# EAGLE design LPC_4TE_TOP_3_52 (EAGLE 5.04)
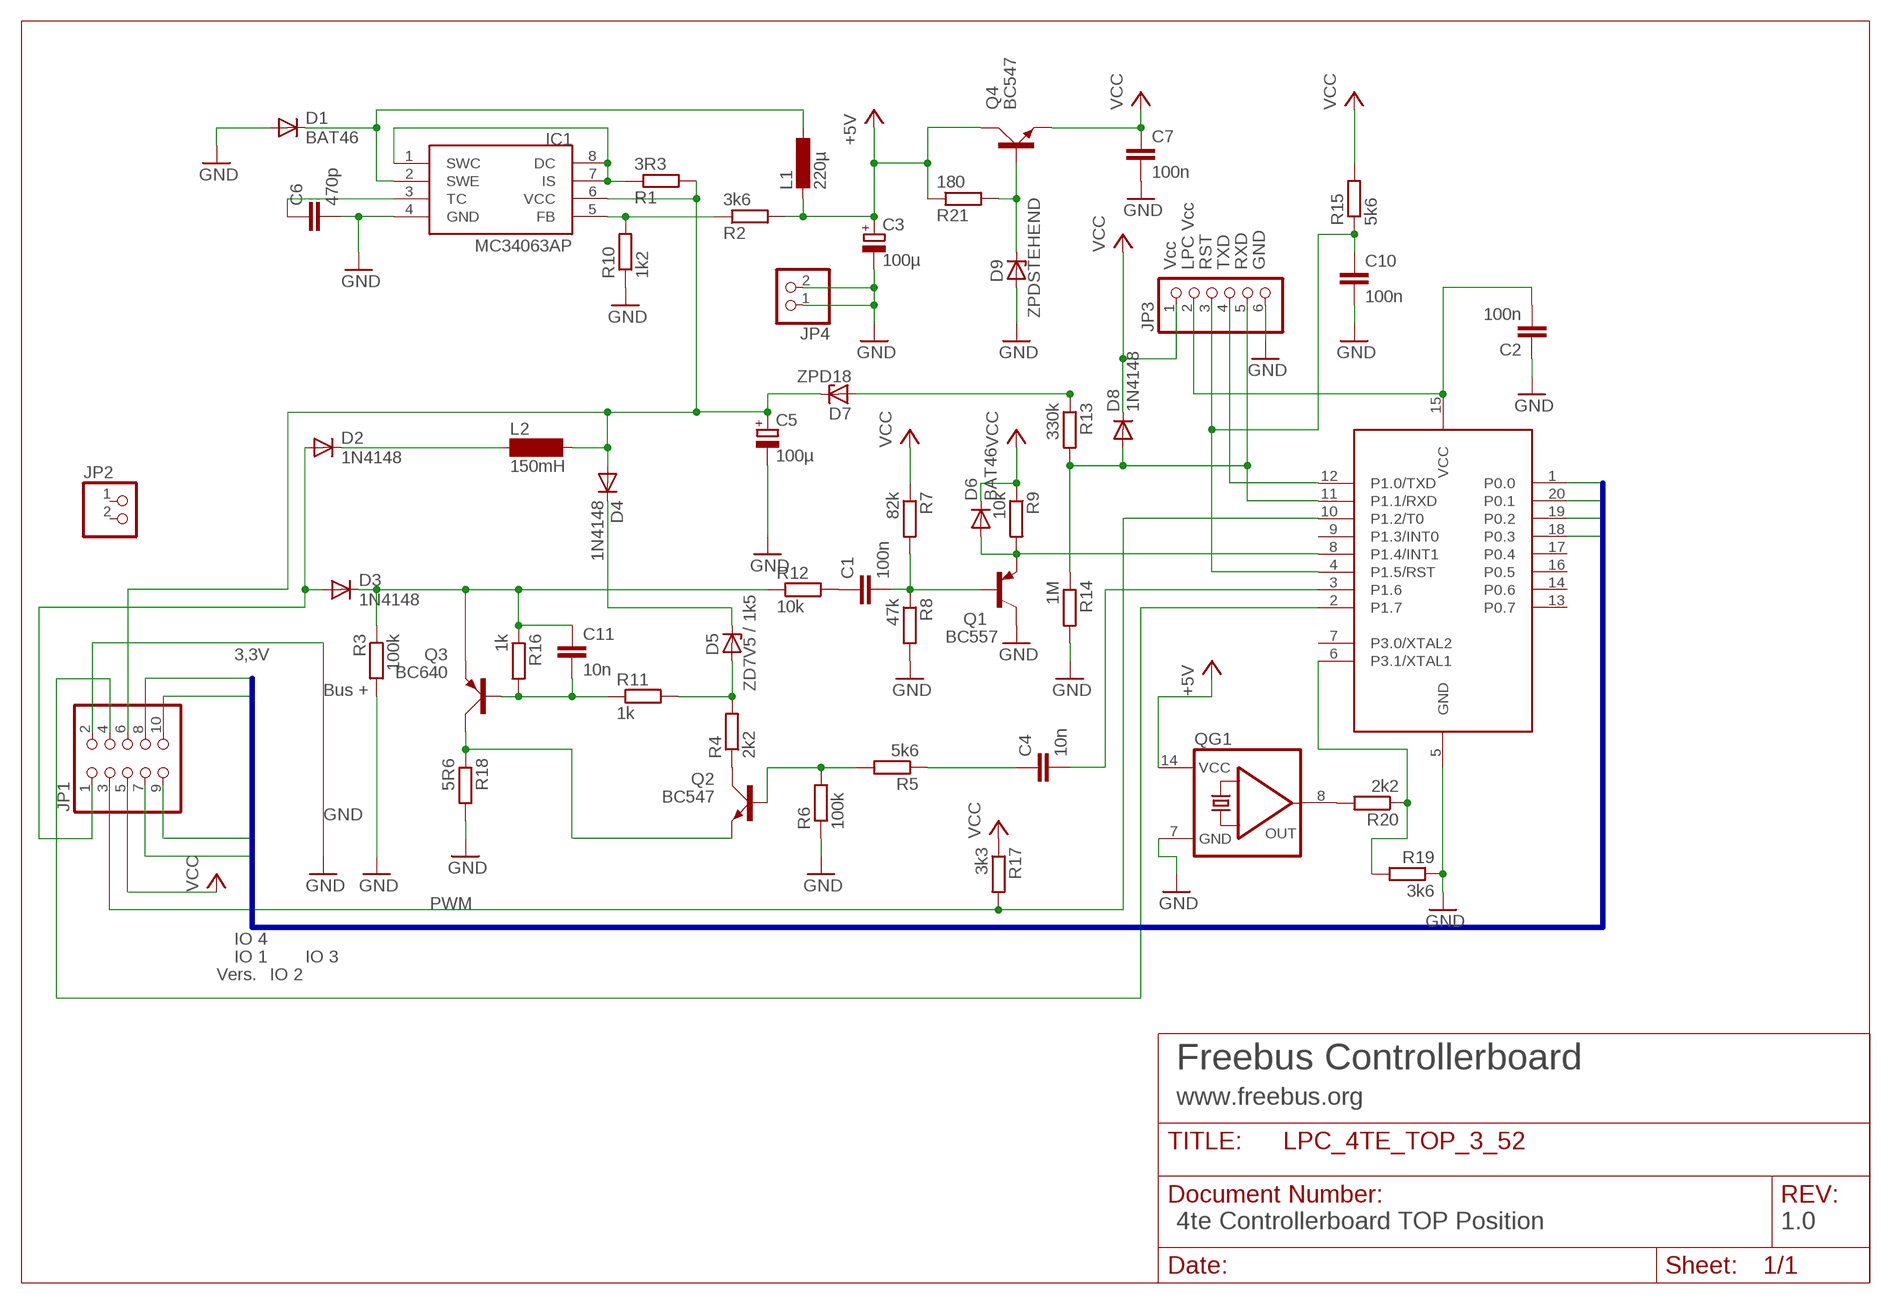
[diagram p0: schematic, sheet 1]

## Parts
89LPC922  89LPC922  [DIL20]
C1  100n  C-EU050-024X044  [C050-024X044]
C2  100n  C-EU025-025X050  [C025-025X050]
C3  100µ  CPOL-EUE2.5-6  [E2,5-6]
C4  10n  C-EUC1206  [C1206]
C5  100µ  CPOL-EUE3.5-8  [E3,5-8]
C6  470p  C-EU025-024X044  [C025-024X044]
C7  100n  C-EU025-025X050  [C025-025X050]
C10  100n  C-EU025-025X050  [C025-025X050]
C11  10n  C-EU050-024X044  [C050-024X044]
D1  BAT46  BAT81  [DO34-7]
D2  1N4148  [DO35-10]
D3  1N4148  [DO35-10]
D4  1N4148  [DO35-10]
D5  ZD7V5 / 1k5  ZPD  [DO35Z10]
D6  BAT46  1N4148  [DO35-10]
D7  ZPD18  ZPD  [DO35Z10]
D8  1N4148  [DO35-10]
D9  ZPDSTEHEND  [ZDIODE]
IC1  MC34063AP  [DIL08]
JP1  PINHD-2X5  [2X05]
JP2  PINHD-1X2  [1X02]
JP3  PINHD-1X6  [1X06]
JP4  PINHD-1X2  [1X02]
L1  220µ  L-EU0207/12  [0207/12]
L2  150mH  BS11  [BS11]
Q1  BC557  [TO92]
Q2  BC547  [SOT54A]
Q3  BC640  [SOT54D]
Q4  BC547  [SOT54A]
QG1  QG5860  [DIL14S]
R1  3R3  R-EU_0204/7  [0204/7]
R2  3k6  R-EU_0204/7  [0204/7]
R3  100k  R-EU_0207/2V  [0207/2V]
R4  2k2  R-EU_R1206  [R1206]
R5  5k6  R-EU_R1206  [R1206]
R6  100k  R-EU_R1206  [R1206]
R7  82k  R-EU_0204/7  [0204/7]
R8  47k  R-EU_0207/2V  [0207/2V]
R9  10k  R-EU_0204/7  [0204/7]
R10  1k2  R-EU_0204/7  [0204/7]
R11  1k  R-EU_R1206  [R1206]
R12  10k  R-EU_0207/2V  [0207/2V]
R13  330k  R-EU_0207/2V  [0207/2V]
R14  1M  R-EU_0207/2V  [0207/2V]
R15  5k6  R-EU_0207/2V  [0207/2V]
R16  1k  R-EU_0207/2V  [0207/2V]
R17  3k3  R-EU_0204/7  [0204/7]
R18  5R6  R-EU_0207/2V  [0207/2V]
R19  3k6  R-EU_R1206  [R1206]
R20  2k2  R-EU_R1206  [R1206]
R21  180  R-EU_0207/2V  [0207/2V]

## Nets
+5V: C3.+ L1.2 Q4.C QG1.14(VCC) R2.2 R21.1
/RESET: 89LPC922.4(P1.5/RST) C10.1 JP3.3 R15.1
EIB+: D2.A D3.A JP1.1
GND: 89LPC922.5(GND) C2.1 C3.- C5.- C6.2 C7.2 C10.2 D1.A D9.A IC1.4(GND) JP1.2 JP3.6 JP4.1 JP4.2 Q1.3(C) QG1.7(GND) R3.2 R6.1 R8.2 R10.1 R14.2 R18.2 R19.1
N$1: 89LPC922.8(P1.4/INT1) D6.A Q1.1(E) R9.2
N$2: C1.2 Q1.2(B) R7.2 R8.1
N$3: QG1.8(OUT) R20.2
N$4: Q2.E Q3.C R18.1
N$5: 89LPC922.3(P1.6) C4.2
N$6: 89LPC922.6(P3.1/XTAL1) R19.2 R20.1
N$7: Q2.B R5.2 R6.2
N$8: IC1.1(SWC) IC1.7(IS) IC1.8(DC) R1.1
N$10: 89LPC922.11(P1.1/RXD) D8.A JP3.5 R13.2 R14.1
N$11: IC1.5(FB) R2.1 R10.2
N$12: D1.C IC1.2(SWE) L1.1
N$13: D2.C L2.1
N$14: C6.1 IC1.3(TC)
N$15: D4.C D5.C
N$16: C1.1 R12.2
N$17: C4.1 R5.1
N$18: Q2.C R4.1
N$19: D5.A R4.2 R11.2
N$20: C11.1 D3.C Q3.E R3.1 R12.1 R16.1
N$23: D9.C Q4.B R21.2
N$25: D7.A R13.1
N$28: C11.2 Q3.B R11.1 R16.2
N$29: 89LPC922.12(P1.0/TXD) JP3.4
N$32: 89LPC922.15(VCC) C2.2 JP3.2
P0.0: 89LPC922.1(P0.0) JP1.7
P0.1: 89LPC922.20(P0.1) JP1.8
P0.2: 89LPC922.19(P0.2) JP1.9
P0.3: 89LPC922.18(P0.3) JP1.10
PROG: 89LPC922.2(P1.7) JP1.4
PWM: 89LPC922.10(P1.2/T0) JP1.3 R17.2
VCC: C7.1 D6.C D8.C JP1.5 JP3.1 Q4.E R7.1 R9.1 R15.2 R17.1
VERS: C5.+ D4.A D7.C IC1.6(VCC) JP1.6 L2.2 R1.2
Unconnected: 89LPC922.7(P3.0/XTAL2) 89LPC922.9(P1.3/INT0) 89LPC922.13(P0.7) 89LPC922.14(P0.6) 89LPC922.16(P0.5) 89LPC922.17(P0.4) JP2.1 JP2.2

## Buses
P0.[0..3]

## Notes on the sheet
- Vcc | LPC Vcc | RST | TXD | RXD | GND
- 3,3V
- Bus +
- GND
- PWM
- IO 4
- IO 1 | IO 3
- Vers. | IO 2
- Freebus Controllerboard
- www.freebus.org
- 4te Controllerboard TOP Position | 1.0

## Library data of the parts
89LPC922 = micro-philips:89LPC922
C1 C2 C4 C6 C7 C10 C11 = rcl:C-EU: CAPACITOR, European symbol
C3 C5 = rcl:CPOL-EU: POLARIZED CAPACITOR, European symbol
D1 = diode:BAT81: DIODE barrier diode
D2-D4 D6 D8 = diode:1N4148: DIODE high speed (Philips)
D5 D7 D9 = diode:ZPD: Z DIODE 500 mW
IC1 = mc34063:MC34063
JP1 = pinhead:PINHD-2X5: PIN HEADER
JP2 JP4 = pinhead:PINHD-1X2: PIN HEADER
JP3 = pinhead:PINHD-1X6: PIN HEADER
L1 = rcl:L-EU: INDUCTOR, European symbol
L2 = inductor-neosid:BS: INDUCTOR nominal inductance, magnetically screened
Q1 = transistor-pnp:BC557: PNP Transistor
Q2 Q4 = transistor-small-signal:BC547: NPN TRANSISTOR
Q3 = transistor-small-signal:BC640: PNP TRANSISTOR
QG1 = crystal:QG5860: CRYSTAL RESONATOR
R1-R21 = rcl:R-EU_: RESISTOR, European symbol

## Board
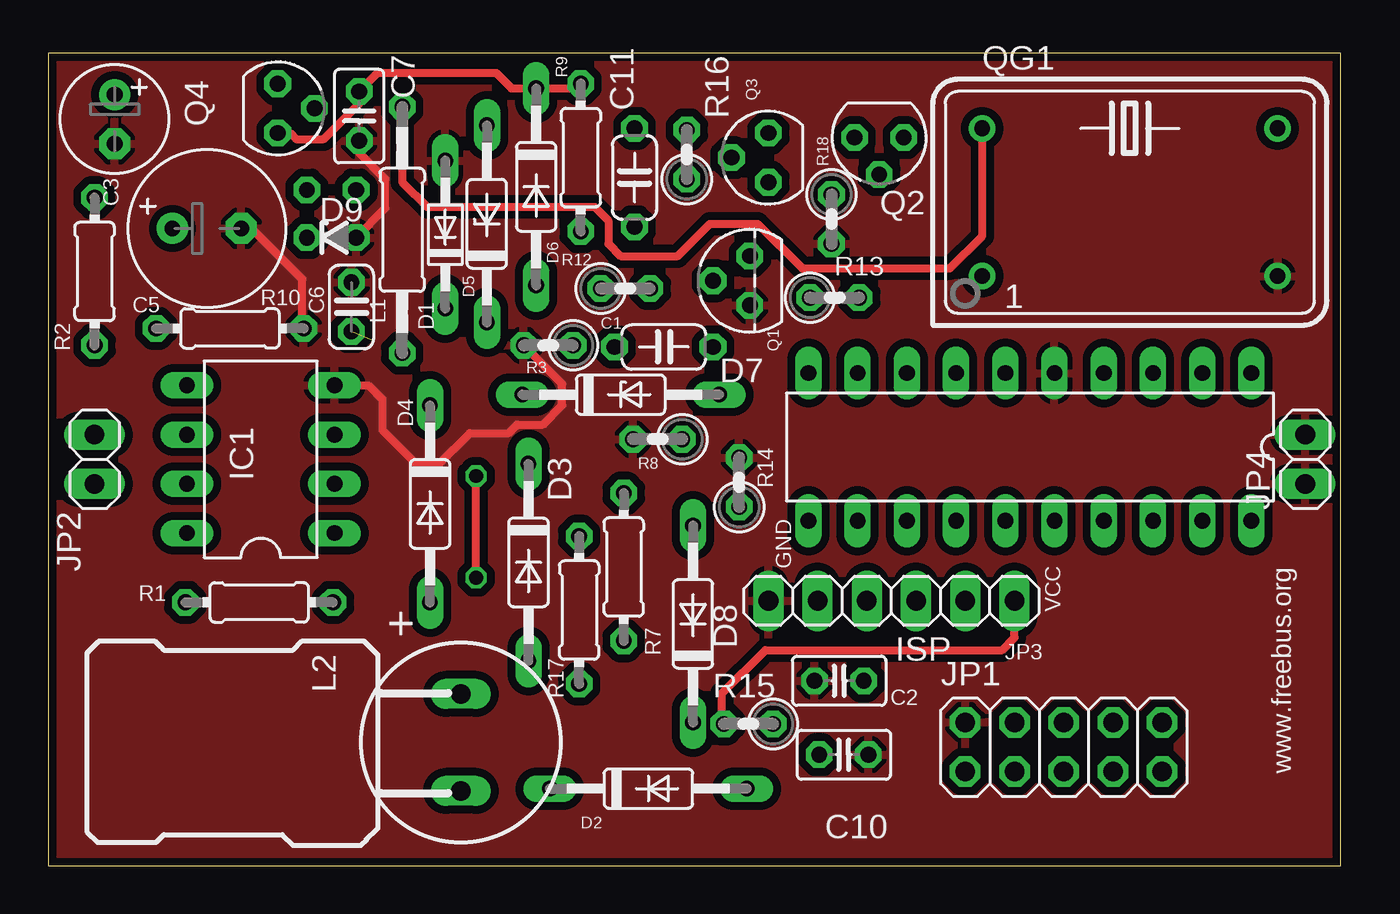
[diagram p1: board, top side]
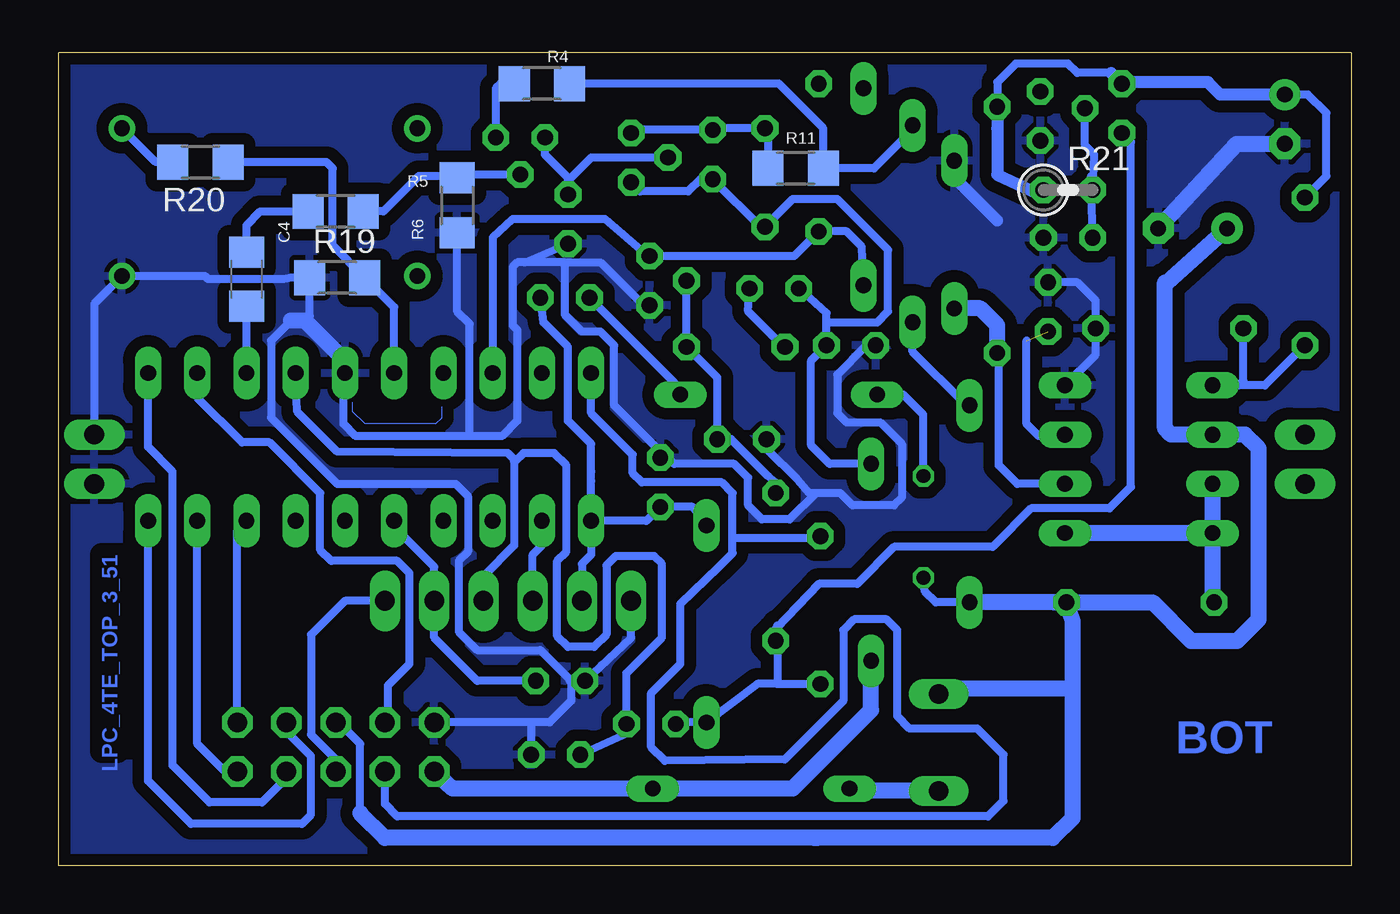
[diagram p2: board, bottom side, seen from below]

Size 66.68 x 41.91 mm. Coordinates in mm from the lower left corner, seen from the top.
Outline: 0,41.91 0,0 66.68,0 66.68,41.91 0,41.91
Copper layers (1*16): Top 0.035mm / dielectric 1.5mm / Bottom 0.035mm
Design rules "default_freebus": minimum track width 10mil, minimum drill 24mil, track to track 8mil, track to pad 8mil, pad to pad 8mil, via to via 8mil, smd to smd 8mil, copper to edge 12mil, drill to drill 8mil, minimum pad ring 11mil, minimum via ring 8mil, stop-mask expansion 4mil, vias tented up to drill 0mil, thermal gap 10mil

### Footprints (pad centres in the part's own frame; a part is rotated, then mirrored left to right if it is on the bottom)
DIL20@1 = drill 0.813 long: 1 -11.43,-3.81; 2 -8.89,-3.81; 3 -6.35,-3.81; 4 -3.81,-3.81; 5 -1.27,-3.81; 6 1.27,-3.81; 7 3.81,-3.81; 8 6.35,-3.81; 9 8.89,-3.81; 10 11.43,-3.81; 11 11.43,3.81; 12 8.89,3.81; 13 6.35,3.81; 14 3.81,3.81; 15 1.27,3.81; 16 -1.27,3.81; 17 -3.81,3.81; 18 -6.35,3.81; 19 -8.89,3.81; 20 -11.43,3.81
C050-024X044 = drill 0.813 octagon: 1 -2.54,0; 2 2.54,0
C025-025X050 = drill 0.813 octagon: 1 -1.27,0; 2 1.27,0
E2,5-6 = drill 0.813 pad 1.6 round: + -1.27,0 | drill 0.813 pad 1.6 octagon: - 1.27,0
C1206 = smd 1.6 x 1.8: 1 -1.4,0; 2 1.4,0
E3,5-8 = drill 0.813 pad 1.6 round: + -1.778,0 | drill 0.813 pad 1.6 octagon: - 1.778,0
C025-024X044 = drill 0.813 octagon: 1 -1.27,0; 2 1.27,0
DO34-7 = drill 0.813 long: A 3.81,0; C -3.81,0
DO35-10 = drill 0.813 long: A 5.08,0; C -5.08,0
DO35Z10 = drill 0.813 long: A 5.08,0; C -5.08,0
ZDIODE = drill 0.813 octagon: A 1.27,0; C -1.27,0
DIL08 = drill 0.813 long: 1 -3.81,-3.81; 2 -1.27,-3.81; 3 1.27,-3.81; 4 3.81,-3.81; 5 3.81,3.81; 6 1.27,3.81; 7 -1.27,3.81; 8 -3.81,3.81
2X05 = drill 1.016 octagon: 1 -5.08,-1.27; 2 -5.08,1.27; 3 -2.54,-1.27; 4 -2.54,1.27; 5 0,-1.27; 6 0,1.27; 7 2.54,-1.27; 8 2.54,1.27; 9 5.08,-1.27; 10 5.08,1.27
1X02 = drill 1.016 long: 1 -1.27,0; 2 1.27,0
1X06 = drill 1.016 long: 1 -6.35,0; 2 -3.81,0; 3 -1.27,0; 4 1.27,0; 5 3.81,0; 6 6.35,0
0207/12 = drill 0.813 octagon: 1 -6.35,0; 2 6.35,0
BS11 = drill 1 long: 1 -2.5,0; 2 2.5,0
TO92 = drill 0.813 octagon: 1 1.27,0; 2 0,1.905; 3 -1.27,0
SOT54A = drill 0.813 octagon: B 0,1.905; C -1.27,0; E 1.27,0
SOT54D = drill 0.813 octagon: B 1.27,0; C 0,1.905; E -1.27,0
DIL14S = drill 0.813 round: 1 -7.62,-3.81; 7 7.62,-3.81; 8 7.62,3.81; 14 -7.62,3.81
0204/7 = drill 0.813 octagon: 1 -3.81,0; 2 3.81,0
0207/2V = drill 0.813 octagon: 1 -1.27,0; 2 1.27,0
R1206 = smd 1.6 x 1.803: 1 -1.422,0; 2 1.422,0

### Placement (x,y rotation side)
89LPC922  89LPC922  [DIL20@1]  50.64,21.59 180 top
C1  31.75,26.75 0 top
C2  40.8,9.53 0 top
C3  3.41,38.5 270 top
C4  56.99,30.24 270 bottom
C5  8.17,32.86 0 top
C6  15.64,28.81 90 top
C7  16.03,38.66 270 top
C10  41.04,5.72 0 top
C11  30.24,35.48 90 top
D1  20.48,32.54 90 top
D2  30.96,3.97 0 top
D3  24.76,15.64 270 top
D4  19.68,18.65 270 top
D5  22.62,33.1 90 top
D6  25.16,35.01 270 top
D7  29.53,24.29 0 top
D8  33.26,12.46 90 top
D9  14.6,32.39 0 top
IC1  10.95,20.96 90 top
JP1  52.39,6.11 0 top
JP2  2.38,20.96 90 top
JP3  43.5,13.65 180 top
JP4  64.85,20.96 90 top
L1  18.26,32.78 90 top
L2  21.27,6.35 90 top
Q1  36.19,30.16 90 top
Q2  42.86,37.55 180 top
Q3  37.15,36.51 90 top
Q4  11.83,39.05 270 top
QG1  55.8,34.21 0 top
R1  10.87,13.57 0 top
R2  2.38,30.64 90 top
R3  25.8,26.83 180 top
R4  41.75,40.32 0 bottom
R5  52.39,33.73 0 bottom
R6  46.12,34.05 90 bottom
R7  29.69,15.4 90 top
R8  31.43,21.99 180 top
R9  27.46,36.51 270 top
R10  9.37,27.7 180 top
R11  28.65,35.96 0 bottom
R12  29.76,29.77 0 top
R13  40.56,29.29 0 top
R14  35.64,19.76 90 top
R15  36.12,7.3 180 top
R16  32.94,36.67 90 top
R17  27.38,13.18 90 top
R18  40.4,33.34 270 top
R19  52.31,30.32 0 bottom
R20  59.37,36.27 180 bottom
R21  14.6,34.85 0 bottom

### Tracks (layer width: path | path; a pad name or v marks a point on that pad's centre or on a via)
+5V
  Top 0.406: L1.2 18.26,35.24 19.53,33.97 28.18,33.97 28.89,33.26 28.89,32.07 29.53,31.43 32.46,31.43 34.13,33.1 36.59,33.1 38.89,30.8 46.51,30.8 48.18,32.46 QG1.14
  Bottom 0.406: C3.+ 2.22,39.77 1.27,38.81 1.27,35.56 R2.2 | 12.38,40.88 14.13,40.88 14.6,41.35 17.3,41.35 18.26,40.4 L1.2
  Bottom 0.61: C3.+ 6.75,39.77 7.38,40.4 11.75,40.4 Q4.C 12.38,40.88 | 18.26,39.37 L1.2 18.26,38.02 18.26,35.64 16.19,34.69 R21.1
/RESET
  Bottom 0.406: 89LPC922.4 54.37,23.42 52.31,21.35 43.5,21.27 43.18,20.96 43.18,20.8 | 43.18,20.8 43.18,16.51 44.77,14.92 JP3.3 | 43.18,20.8 42.7,21.27 41.12,21.27 40.48,20.64 40.48,16.19 40.96,15.72 40.96,11.83 40.4,11.27 39.05,11.27 38.42,11.91 38.42,15.48 37.94,15.95 35.96,15.95 35.56,15.56 35.56,11.75 37.39,9.92 R15.1 37.31,6.83 C10.1
EIB+
  Bottom 0.813: JP1.1 46.35,3.97 40.8,3.97 D2.A 28.81,3.97 24.76,8.02 D3.A 24.76,10.24
GND
  Top 0.406: C5.- 10.16,33.18 13.1,30.24 13.1,27.78 R10.1 | IC1.4 16.51,24.77 17.22,24.05 17.22,22.46 18.97,20.72 20.16,20.72 21.75,22.3 23.73,22.3 24.17,22.74 25.52,22.74 26.51,23.73 26.51,24.84 R3.2 | C7.2 16.03,36.75 17.38,35.4 17.38,33.89 D9.A
  Bottom 0.406: 40.24,9.53 40.24,8.49 41.35,7.38 42.31,7.38 | 40.24,9.53 41.83,11.11 45.08,11.11 46.04,12.07 46.04,12.54 46.04,15.72 45.56,16.19 45.56,19.05 46.2,19.69 52.31,19.69 55.72,23.1 55.72,27.07 54.69,28.1 | 42.31,7.38 JP1.2 | JP1.2 | 89LPC922.5 51.91,25.72 | C10.2 42.31,6.83 42.31,7.38 | JP3.6 37.15,11.75 C2.1 40.32,9.53 40.24,9.53 | 89LPC922.5 51.99,25.32 51.99,22.78 51.35,22.15 45.48,22.15 | 89LPC922.5 | 27.62,19.21 28.97,17.86 30.4,17.86 31.11,18.57 31.11,20 31.83,20.72 34.92,20.72 35.24,21.03 R14.2 35.64,21.35 38.02,23.73 38.02,26.83 38.73,27.54 39.69,27.54 40.56,28.42 40.56,31.12 | 27.62,19.21 26.35,19.21 25.72,18.57 23.57,18.57 23.18,18.97 23.18,21.75 24.29,22.86 26.03,22.86 26.51,23.34 26.51,25.32 25.08,26.75 24.61,26.75 R3.2 24.53,26.51 | 27.62,19.21 27.94,19.21 28.57,19.92 30.08,21.43 30.08,21.99 30.16,21.91 R8.2 30.08,22.07 | Q1.3 36.51,28.89 38.73,31.12 40.56,31.12 | 40.56,31.12 42.62,31.12 | 42.62,31.12 43.02,31.12 43.26,30.88 43.26,27.86 43.02,27.62 43.02,22.94 43.81,22.15 45.48,22.15 | 42.62,31.12 R18.2 | IC1.4 13.18,26.35 R10.1 13.18,29.13 14.13,30.08 C6.2 | C6.2 | JP4.2 64.85,28.97 QG1.7 59.13,30.4 58.98,30.24 55.09,30.24 54.69,30.32 R19.1 53.73,28.34 53.97,28.1 | R6.1 46.12,28.58 45.48,27.94 45.48,22.15
  Bottom 0.61: 18.26,33.26 20.48,35.48 D1.A
  Bottom 0.813: 51.91,25.72 51.91,26.04 53.97,28.1 54.69,28.1 | C3.- 5.9,37.23 C5.-
  pour Bottom (isolate 0.61): 0,42.23 67.15,42.23 67.15,-0.32 -0.4,-0.32 -0.4,41.99
  pour Top (isolate 0.406): -0.16,41.99 67.15,41.99 67.15,-0.16 -0.16,-0.16 -0.16,41.35
N$1
  Bottom 0.406: 89LPC922.8 44.29,25.88 | 44.29,25.88 | 44.29,25.96 89LPC922.8 | 44.29,25.96 44.29,26.35 44.29,27.78 44.29,32.39 43.26,33.34 38.5,33.34 36.27,31.43 Q1.1 33.65,31.43 33.34,31.43 31.91,31.43 31.59,31.43 30.96,31.43 30.8,31.43 28.73,31.43 R9.2 26.03,32.7 25.24,31.91 D6.A | 89LPC922.8 44.21,25.48 | 44.53,25.88 44.37,25.88 44.29,25.96
N$2
  Bottom 0.406: Q1.2 34.29,27.46 C1.2 32.7,25.16 R8.1 31.99,21.99 30.08,20.08 29.69,19.76 R7.2
N$3
  Bottom 0.406: R20.2 61.67,36.27 QG1.8
N$4
  Bottom 0.406: Q3.C 39.21,36.51 40.32,35.4 | 40.32,35.4 40.4,35.32 R18.1 | Q2.E 41.59,36.67 40.32,35.4
N$5
  Bottom 0.406: 89LPC922.3 C4.2
N$6
  Bottom 0.406: 89LPC922.6 49.37,28.81 R19.2 52.55,31.98 52.55,35.96 52.86,36.27 R20.1
N$7
  Bottom 0.406: Q2.B 45.95,35.64 R6.2 46.2,35.56 48.1,35.56 49.93,33.73 R5.2
N$8
  Bottom 0.813: IC1.8 IC1.1 | IC1.8 IC1.7 | IC1.8 7.14,13.42 R1.1
N$9
  Bottom 0: 51.51,23.89 51.51,23.42 50.88,22.78 47.23,22.78 46.91,23.1 46.91,23.65
N$10
  Bottom 0.406: JP3.5 39.69,15.56 39.21,16.03 89LPC922.11 | 89LPC922.11 39.21,19.84 39.21,20.32 39.21,21.75 40.4,22.94 40.4,26.75 41.67,28.02 R13.2 | 89LPC922.11 36.35,17.78 R14.1 33.97,18.49 D8.A
N$11
  Bottom 0.406: R2.1 4.45,24.77 5.79,24.77 | 5.79,24.77 IC1.5 | R10.2 5.56,25 5.79,24.77
N$12
  Bottom 0.406: IC1.2 17.22,19.68 18.18,20.64 18.18,26.43 L1.1
  Bottom 0.813: L1.1 18.26,27.86 19.13,28.73 D1.C | D1.C
N$13
  Bottom 0.813: D2.C 25.76,3.85 L2.1
N$14  (1 unrouted)
  Bottom 0.406: IC1.3 14.84,22.15 16.11,22.15 16.75,22.78 16.75,27.07
N$15
  Bottom 0.406: D4.C 19.92,23.81 22.62,26.51 D5.C | D5.C
N$16
  Bottom 0.406: C1.1 29.29,26.75 31.11,28.58 R12.2
N$17
  Bottom 0.406: C4.1 56.99,33.02 56.28,33.73 R5.1
N$18
  Bottom 0.406: Q2.C 44.13,40.08 43.89,40.32 R4.1
N$19
  Bottom 0.406: D5.A 22.62,37.94 24.61,35.96 R11.2 | R11.2 | R4.2 29.53,40.32 27.23,38.02 R11.2
N$20
  Bottom 0.406: D3.C 26.91,20.72 27.86,21.67 27.86,26.04 R3.1 27.07,28.02 | 27.07,28.02 27.07,28.5 R12.1 | 27.07,28.02 24.45,28.02 23.89,28.58 23.89,31.75 26.51,34.37 28.81,34.37 C11.1 30.32,32.86 30.4,32.86 R16.1 33.58,35.4 34.21,34.77 36.67,34.77 Q3.E
N$23
  Bottom 0.406: D9.C 13.41,35.56 R21.2 13.26,36.67 13.73,37.15 Q4.B
N$25
  Bottom 0.406: R13.1 34.92,24.92 D7.A
N$28
  Bottom 0.406: Q3.B 36.99,37.94 R16.2 32.86,38.02 C11.2 30.08,37.86 R11.1
N$29
  Bottom 0.406: JP3.4 42.23,16.03 41.75,16.51 89LPC922.12
N$32
  Bottom 0.406: JP3.2 47.31,15.4 49.37,17.46 89LPC922.15 | JP3.2 47.31,14.61 47.31,13.34 | C2.2 45.08,9.53 47.31,11.75 JP3.2
P0.0
  Bottom 0.406: JP1.7 54.93,4.52 56.2,3.25 58.9,3.25 60.8,5.16 60.8,20.32 62.07,21.59 89LPC922.1
P0.1
  Bottom 0.406: JP1.8 54.93,6.91 53.66,5.64 53.66,2.62 54.13,2.14 59.85,2.14 62.07,4.37 89LPC922.20
P0.2
  Bottom 0.406: JP1.9 58.1,4.84 59.53,6.27 89LPC922.19
P0.3
  Bottom 0.406: JP1.10 57.47,17.3 89LPC922.18
PROG
  Bottom 0.406: 89LPC922.2 59.53,24.13 57.23,21.83 55.8,21.83 53.18,19.21 53.18,16.27 52.63,15.72 49.21,15.72 48.58,15.08 48.58,10.4 49.69,9.29 49.69,7.54 JP1.4 50.01,7.54
PWM
  Bottom 0.406: JP1.3 49.85,3.18 49.21,2.54 18.73,2.54 17.94,3.33 17.94,5.72 19.29,7.06 22.78,7.06 23.42,7.7 23.42,12.14 23.97,12.7 25.64,12.7 26.19,12.14 26.19,8.49 26.43,8.26 29.21,5.48 35.4,5.4 36.12,6.11 36.12,8.89 34.61,10.4 34.61,13.49 32.62,15.4 31.91,16.11 31.91,16.91 | 89LPC922.10 39.21,23.34 37.07,21.19 37.07,20.24 36.59,19.76 32.46,19.76 31.91,19.21 31.91,16.91 | R17.2 27.38,16.91 31.91,16.91
VCC
  Top 0.406: Q4.E 12.46,37.78 12.78,37.47 14.21,37.47 16.03,39.29 C7.1 16.99,40.88 23.1,40.88 23.89,40.08 D6.C | D6.C | D6.C 27.22,40.08 R9.1 | JP3.1 49.85,11.75 49.21,11.11 36.99,11.11 34.77,8.89 34.77,7.38 R15.2
  Bottom 0.406: R15.2 34.61,7.38 D8.C 30.64,9.37 29.61,9.37 | 29.61,9.37 R17.1 | 29.61,9.37 29.61,12.38 R7.1 29.69,12.22 27.46,14.53 25.48,14.53 23.57,16.43 18.49,16.43 18.41,16.51 16.51,18.42 12.46,18.42 11.35,19.53 11.35,37.31 Q4.E | JP1.5 52.39,5.48 53.66,6.75 53.66,11.91 51.91,13.65 JP3.1
VERS  (via drill 0.7)
  Top 0.406: v22.07,14.84 v22.07,20.08
  Bottom 0.406: IC1.6 | IC1.6 | JP1.6 52.23,7.38 51.12,6.27 51.12,2.7 | D4.A 21.43,13.57 21.99,14.13 v22.07,14.84 | v22.07,20.08 22.07,23.26 23.1,24.29 D7.C
  Bottom 0.813: 51.12,2.7 49.85,1.43 27.7,1.43 | 27.7,1.43 27.54,1.43 | R1.2 10.24,13.57 8.25,11.59 5.87,11.59 4.76,12.7 4.76,21.51 5.48,22.23 IC1.6 | IC1.6 | 14.37,9.13 14.37,2.46 15.4,1.43 27.7,1.43 | 14.37,9.13 14.37,12.62 R1.2 | IC1.6 9.29,22.23 9.6,22.54 9.6,30.08 9.49,30.08 C5.+ | R1.2 15.32,13.57 D4.A | L2.2 20.99,9.13 14.37,9.13

### Text on the board
Bottom: LPC_4TE_TOP_3_51 | BOT
tPlace: +
tNames: GND | www.freebus.org | VCC | ISP